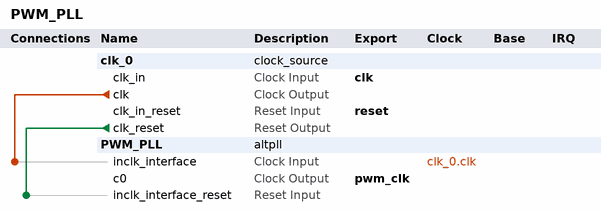
[diagram p0: system contents]
# Platform Designer (Qsys) system PWM_PLL, MAX 10 10M50DAF484C7G
# Parameters at their usual value, and those the tool derives, are not listed.
package require -exact qsys 20.1
create_system PWM_PLL
set_project_property DEVICE_FAMILY {MAX 10}
set_project_property DEVICE 10M50DAF484C7G

add_instance clk_0 clock_source 20.1
set_instance_parameter_value clk_0 clockFrequency 50000000

add_instance PWM_PLL altpll 20.1
set_instance_parameter_value PWM_PLL CLK0_DIVIDE_BY 1000
set_instance_parameter_value PWM_PLL CLK0_MULTIPLY_BY 3
set_instance_parameter_value PWM_PLL INCLK0_INPUT_FREQUENCY 20000
set_instance_parameter_value PWM_PLL PORT_ARESET PORT_USED
set_instance_parameter_value PWM_PLL PORT_LOCKED PORT_USED
set_instance_parameter_value PWM_PLL PORT_clk1 PORT_UNUSED
set_instance_parameter_value PWM_PLL PORT_clk2 PORT_UNUSED
set_instance_parameter_value PWM_PLL PORT_clk3 PORT_UNUSED

# connections
add_connection clk_0.clk PWM_PLL.inclk_interface clock
add_connection clk_0.clk_reset PWM_PLL.inclk_interface_reset reset

# exported interfaces
add_interface clk clock sink
set_interface_property clk EXPORT_OF clk_0.clk_in
add_interface pwm_clk clock source
set_interface_property pwm_clk EXPORT_OF PWM_PLL.c0
add_interface reset reset sink
set_interface_property reset EXPORT_OF clk_0.clk_in_reset

set_interconnect_requirement {$system} qsys_mm.clockCrossingAdapter HANDSHAKE
set_interconnect_requirement {$system} qsys_mm.enableEccProtection FALSE
set_interconnect_requirement {$system} qsys_mm.insertDefaultSlave FALSE
set_interconnect_requirement {$system} qsys_mm.maxAdditionalLatency 1

save_system PWM_PLL.qsys
